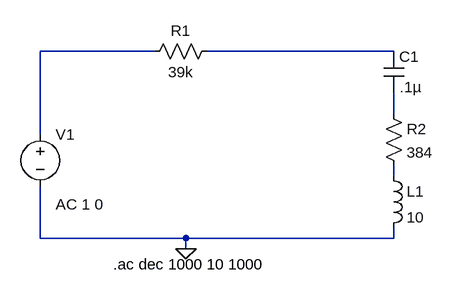
[diagram p0: schematic inductor measurement series.asc]
inductor measurement series.asc, the LTspice schematic file:
Version 4
SHEET 1 880 680
WIRE 128 16 -48 16
WIRE 496 16 208 16
WIRE 496 112 496 80
WIRE -48 144 -48 16
WIRE 496 208 496 192
WIRE -48 304 -48 224
WIRE 176 304 -48 304
WIRE 496 304 496 288
WIRE 496 304 176 304
WIRE 176 320 176 304
FLAG 176 320 0
SYMBOL voltage -48 128 R0
WINDOW 123 24 124 Left 2
WINDOW 39 0 0 Left 2
WINDOW 3 24 44 Invisible 2
SYMATTR Value2 AC 1 0
SYMATTR Value ""
SYMATTR InstName V1
SYMBOL res 480 96 R0
SYMATTR InstName R2
SYMATTR Value 384
SYMBOL ind 480 192 R0
SYMATTR InstName L1
SYMATTR Value 10
SYMBOL cap 480 16 R0
WINDOW 3 25 55 Left 2
SYMATTR Value .1µ
SYMATTR InstName C1
SYMBOL res 112 32 R270
WINDOW 0 32 56 VTop 2
WINDOW 3 0 56 VBottom 2
SYMATTR InstName R1
SYMATTR Value 39k
TEXT 64 344 Left 2 !.ac dec 1000 10 1000

The netlist it stands for:
* inductor measurement series.asc
V1 N001 0 AC 1 0
R2 N003 N004 384
L1 N004 0 10
C1 N002 N003 .1µ
R1 N001 N002 39k
.ac dec 1000 10 1000
.backanno
.end